# EAGLE design ardcore_smd (EAGLE 7.6.0)

## Sheet 1 of 2
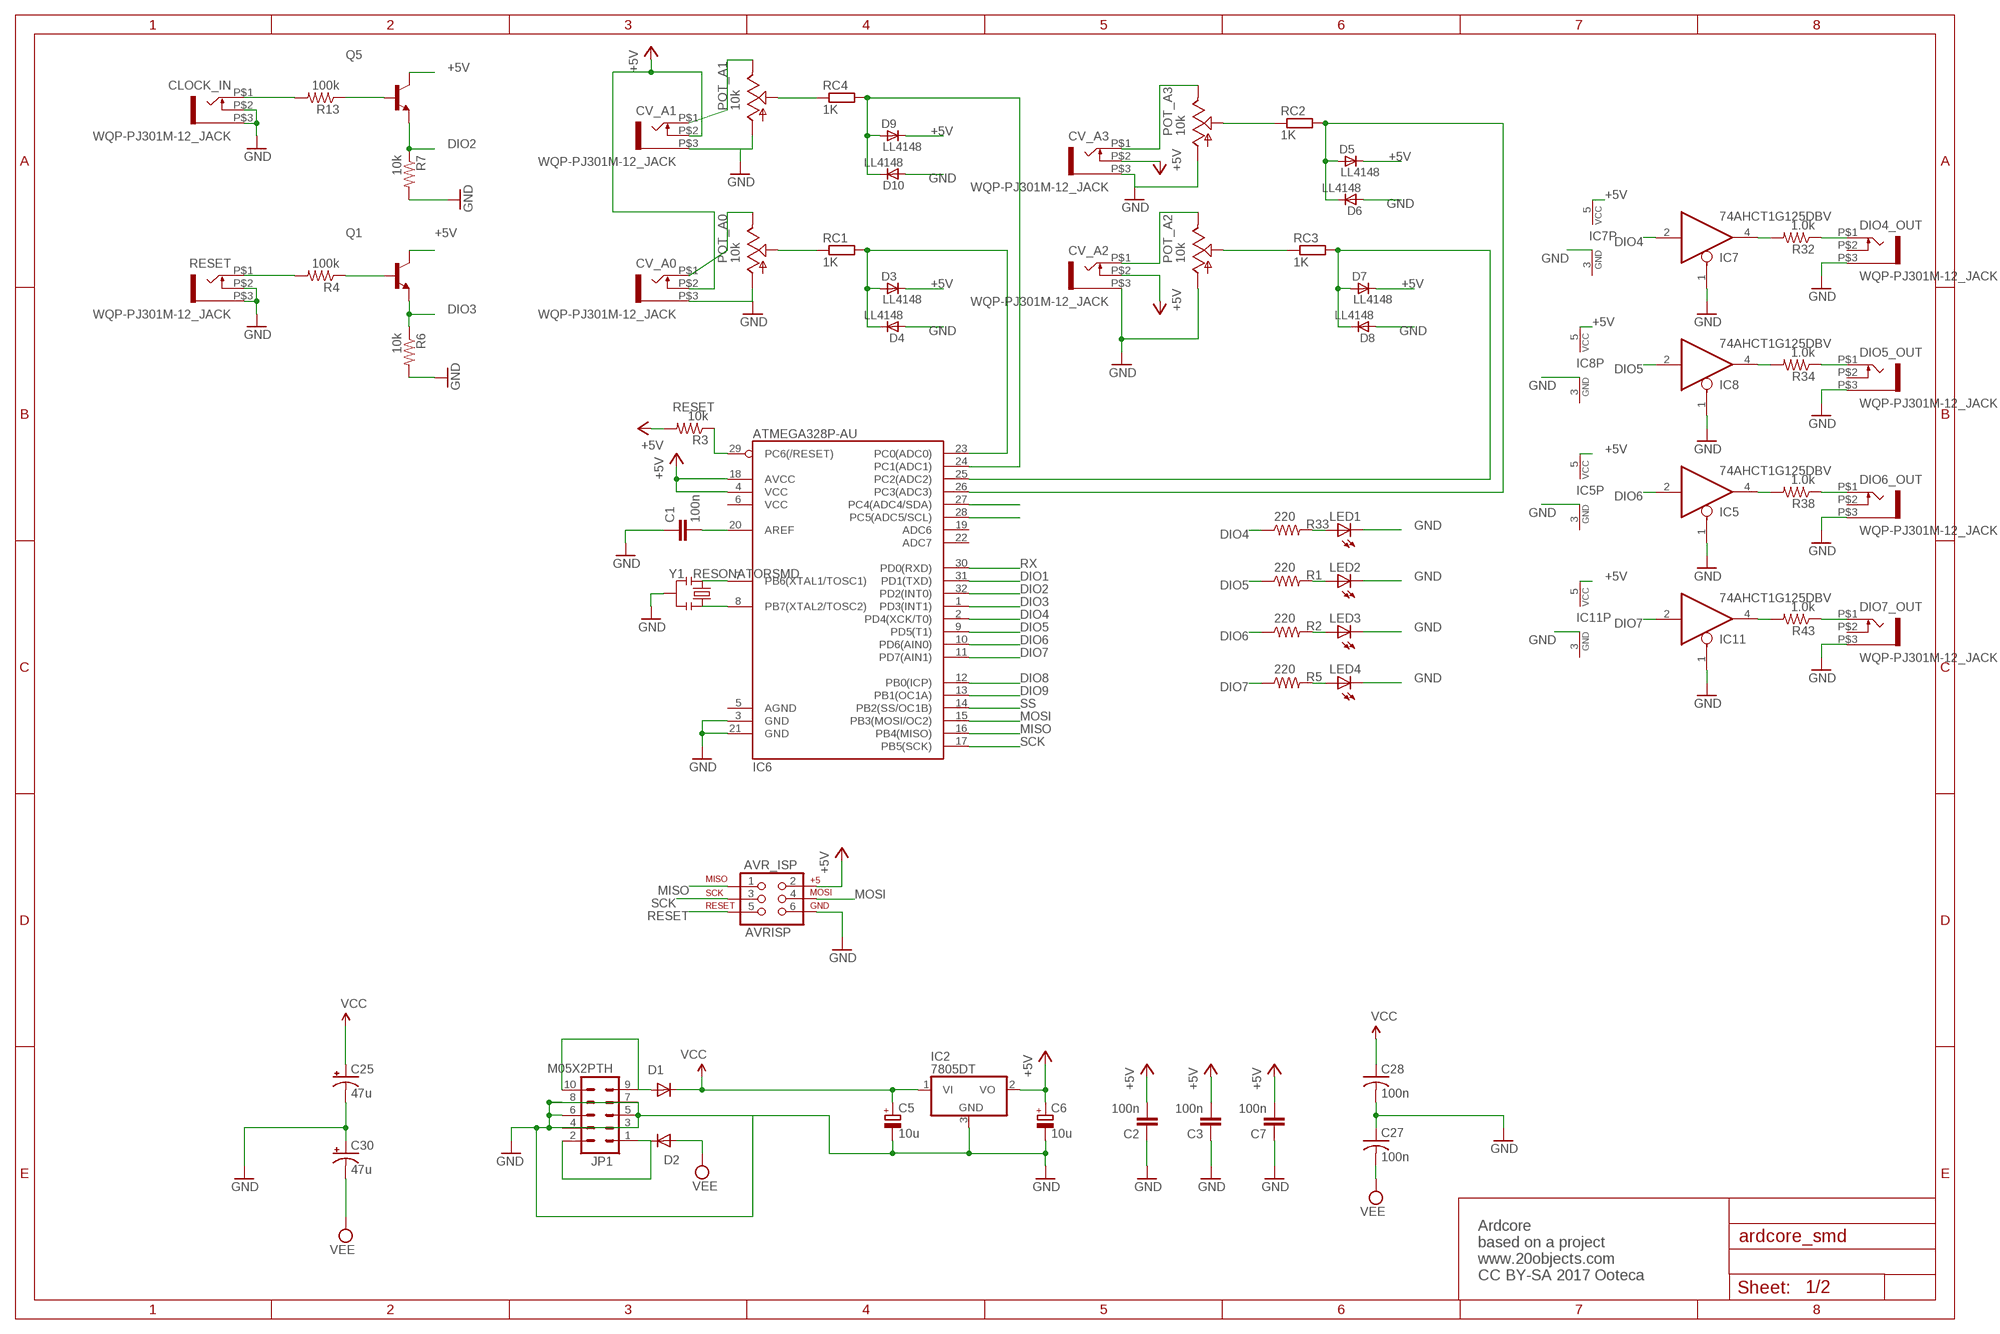
[diagram p0: schematic, sheet 1]

### Parts
AVR_ISP  AVRISP  AVR_SPI_PRG_6PTH  [2X3]
C1  100n  C-EUC0603  [C0603]
C2  100n  C-EUC0603  [C0603]
C3  100n  C-EUC0603  [C0603]
C5  10u  CPOL-EUE2.5-5  [E2,5-5]
C6  10u  CPOL-EUE2.5-5  [E2,5-5]
C7  100n  C-EUC0805  [C0805]
C25  47u  CPOL-USD  [PANASONIC_D]
C27  100n  C-USC0603  [C0603]
C28  100n  C-USC0603  [C0603]
C30  47u  CPOL-USD  [PANASONIC_D]
CLOCK_IN  WQP-PJ301M-12_JACK  [WQP-PJ301M-12_JACK]
CV_A0  WQP-PJ301M-12_JACK  [WQP-PJ301M-12_JACK]
CV_A1  WQP-PJ301M-12_JACK  [WQP-PJ301M-12_JACK]
CV_A2  WQP-PJ301M-12_JACK  [WQP-PJ301M-12_JACK]
CV_A3  WQP-PJ301M-12_JACK  [WQP-PJ301M-12_JACK]
D1  1N5819  DIODE-SOD123  [SOD123]
D2  1N5819  DIODE-SOD123  [SOD123]
D3  LL4148  [SOD80_DO213AA_MINIMELF]
D4  LL4148  [SOD80_DO213AA_MINIMELF]
D5  LL4148  [SOD80_DO213AA_MINIMELF]
D6  LL4148  [SOD80_DO213AA_MINIMELF]
D7  LL4148  [SOD80_DO213AA_MINIMELF]
D8  LL4148  [SOD80_DO213AA_MINIMELF]
D9  LL4148  [SOD80_DO213AA_MINIMELF]
D10  LL4148  [SOD80_DO213AA_MINIMELF]
DIO4_OUT  WQP-PJ301M-12_JACK  [WQP-PJ301M-12_JACK]
DIO5_OUT  WQP-PJ301M-12_JACK  [WQP-PJ301M-12_JACK]
DIO6_OUT  WQP-PJ301M-12_JACK  [WQP-PJ301M-12_JACK]
DIO7_OUT  WQP-PJ301M-12_JACK  [WQP-PJ301M-12_JACK]
IC2  7805DT  [TO252]
IC5  74AHCT1G125DBV  [SOT23-5]
IC6  ATMEGA328P-AU  ATMEGA168  [TQFP32-08]
IC7  74AHCT1G125DBV  [SOT23-5]
IC8  74AHCT1G125DBV  [SOT23-5]
IC11  74AHCT1G125DBV  [SOT23-5]
JP1  M05X2PTH  [AVR_ICSP]
LED1  LED3MM  [LED3MM]
LED2  LED3MM  [LED3MM]
LED3  LED3MM  [LED3MM]
LED4  LED3MM  [LED3MM]
POT_A0  10k  POT_USVERTICAL  [ALPS_POT_VERTICAL]
POT_A1  10k  POT_USVERTICAL  [ALPS_POT_VERTICAL]
POT_A2  10k  POT_USVERTICAL  [ALPS_POT_VERTICAL]
POT_A3  10k  POT_USVERTICAL  [ALPS_POT_VERTICAL]
Q1  MMBT3904LT1-NPN-SOT23-BEC  [SOT23-BEC]
Q5  MMBT3904LT1-NPN-SOT23-BEC  [SOT23-BEC]
R1  220  R-US_R0603  [R0603]
R2  220  R-US_R0603  [R0603]
R3  10k  R-US_R0603  [R0603]
R4  100k  R-US_R0603  [R0603]
R5  220  R-US_R0603  [R0603]
R6  10k  R-US_R0603  [R0603]
R7  10k  R-US_R0603  [R0603]
R13  100k  R-US_R0603  [R0603]
R32  1.0k  R-US_R0603  [R0603]
R33  220  R-US_R0603  [R0603]
R34  1.0k  R-US_R0603  [R0603]
R38  1.0k  R-US_R0603  [R0603]
R43  1.0k  R-US_R0603  [R0603]
RC1  1K  R-EU_R0603  [R0603]
RC2  1K  R-EU_R0603  [R0603]
RC3  1K  R-EU_R0603  [R0603]
RC4  1K  R-EU_R0603  [R0603]
RESET  WQP-PJ301M-12_JACK  [WQP-PJ301M-12_JACK]
Y1  RESONATORSMD  [RESONATOR-SMD]

### Nets
+5V: AVR_ISP.2 C2.2 C3.2 C6.+ C7.2 CV_A0.P$2 CV_A1.P$2 CV_A2.P$2 CV_A3.P$2 D3.C D5.C D7.C D9.C IC2.2(VO) IC5.5(VCC) IC6.4(VCC) IC6.18(AVCC) IC7.5(VCC) IC8.5(VCC) IC11.5(VCC) Q1.C Q5.C R3.2 ; also sheet 2
ANI1: D9.A D10.C IC6.24(PC1(ADC1)) RC4.2
ANI2: D3.A D4.C IC6.23(PC0(ADC0)) RC1.2
ANI3: D5.A D6.C IC6.26(PC3(ADC3)) RC2.2
ANI4: D7.A D8.C IC6.25(PC2(ADC2)) RC3.2
DIO1: IC6.31(PD1(TXD))
DIO2: IC6.32(PD2(INT0)) Q5.E R7.1
DIO3: IC6.1(PD3(INT1)) Q1.E R6.1
DIO4: IC6.2(PD4(XCK/T0)) IC7.2(I) R33.1
DIO5: IC6.9(PD5(T1)) IC8.2(I) R1.1
DIO6: IC5.2(I) IC6.10(PD6(AIN0)) R2.1
DIO7: IC6.11(PD7(AIN1)) IC11.2(I) R5.1
DIO8: IC6.12(PB0(ICP))
DIO9: IC6.13(PB1(OC1A))
GND: AVR_ISP.6 C1.1 C2.1 C3.1 C5.- C6.- C7.1 C25.- C27.1 C28.2 C30.+ CLOCK_IN.P$2 CLOCK_IN.P$3 CV_A0.P$3 CV_A1.P$3 CV_A2.P$3 CV_A3.P$3 D4.A D6.A D8.A D10.A DIO4_OUT.P$3 DIO5_OUT.P$3 DIO6_OUT.P$3 DIO7_OUT.P$3 IC2.3(GND) IC5.1(OE) IC6.3(GND) IC6.21(GND) IC7.1(OE) IC8.1(OE) IC11.1(OE) JP1.3 JP1.4 JP1.5 JP1.6 JP1.7 JP1.8 LED1.K(C) LED2.K(C) LED3.K(C) LED4.K(C) POT_A0.P$3(A) POT_A1.P$3(A) POT_A2.P$3(A) POT_A3.P$3(A) R6.2 R7.2 RESET.P$2 RESET.P$3 Y1.2 ; also sheet 2
MISO: AVR_ISP.1 IC6.16(PB4(MISO))
MOSI: AVR_ISP.4 IC6.15(PB3(MOSI/OC2)) ; also sheet 2
N$3: CV_A2.P$1 POT_A2.P$1(E)
N$5: D1.A JP1.9 JP1.10
N$6: D2.C JP1.1 JP1.2
N$7: DIO6_OUT.P$1 R38.1
N$8: C1.2 IC6.20(AREF)
N$9: DIO5_OUT.P$1 R34.1
N$10: DIO7_OUT.P$1 R43.1
N$11: DIO4_OUT.P$1 R32.1
N$12: CV_A3.P$1 POT_A3.P$1(E)
N$13: IC7.4(O) R32.2
N$14: Q1.B R4.1
N$15: R4.2 RESET.P$1
N$16: IC8.4(O) R34.2
N$17: Q5.B R13.1
N$18: IC6.7(PB6(XTAL1/TOSC1)) Y1.1
N$19: IC6.8(PB7(XTAL2/TOSC2)) Y1.3
N$20: LED2.A R1.2
N$21: LED3.A R2.2
N$22: CLOCK_IN.P$1 R13.2
N$23: LED4.A R5.2
N$25: CV_A0.P$1 POT_A0.P$1(E)
N$27: POT_A3.P$2(S) RC2.1
N$28: CV_A1.P$1 POT_A1.P$1(E)
N$29: POT_A2.P$2(S) RC3.1
N$30: POT_A0.P$2(S) RC1.1
N$31: POT_A1.P$2(S) RC4.1
N$45: IC5.4(O) R38.2
N$46: IC11.4(O) R43.2
N$54: LED1.A R33.2
RESET: AVR_ISP.5 IC6.29(PC6(/RESET)) R3.1
RX: IC6.30(PD0(RXD))
SCK: AVR_ISP.3 IC6.17(PB5(SCK)) ; also sheet 2
SS: IC6.14(PB2(SS/OC1B)) ; also sheet 2
SW_BLUE: IC6.28(PC5(ADC5/SCL))
SW_YELLOW: IC6.27(PC4(ADC4/SDA))
VCC: C5.+ C25.+ C28.1 D1.C IC2.1(VI) ; also sheet 2
VEE: C27.2 C30.- D2.A ; also sheet 2
Unconnected: DIO4_OUT.P$2 DIO5_OUT.P$2 DIO6_OUT.P$2 DIO7_OUT.P$2 IC6.5(AGND) IC6.6(VCC) IC6.19(ADC6) IC6.22(ADC7)

### Notes on the sheet
- Ardcore
  based on a project
  www.20objects.com
  CC BY-SA 2017 Ooteca

## Sheet 2 of 2
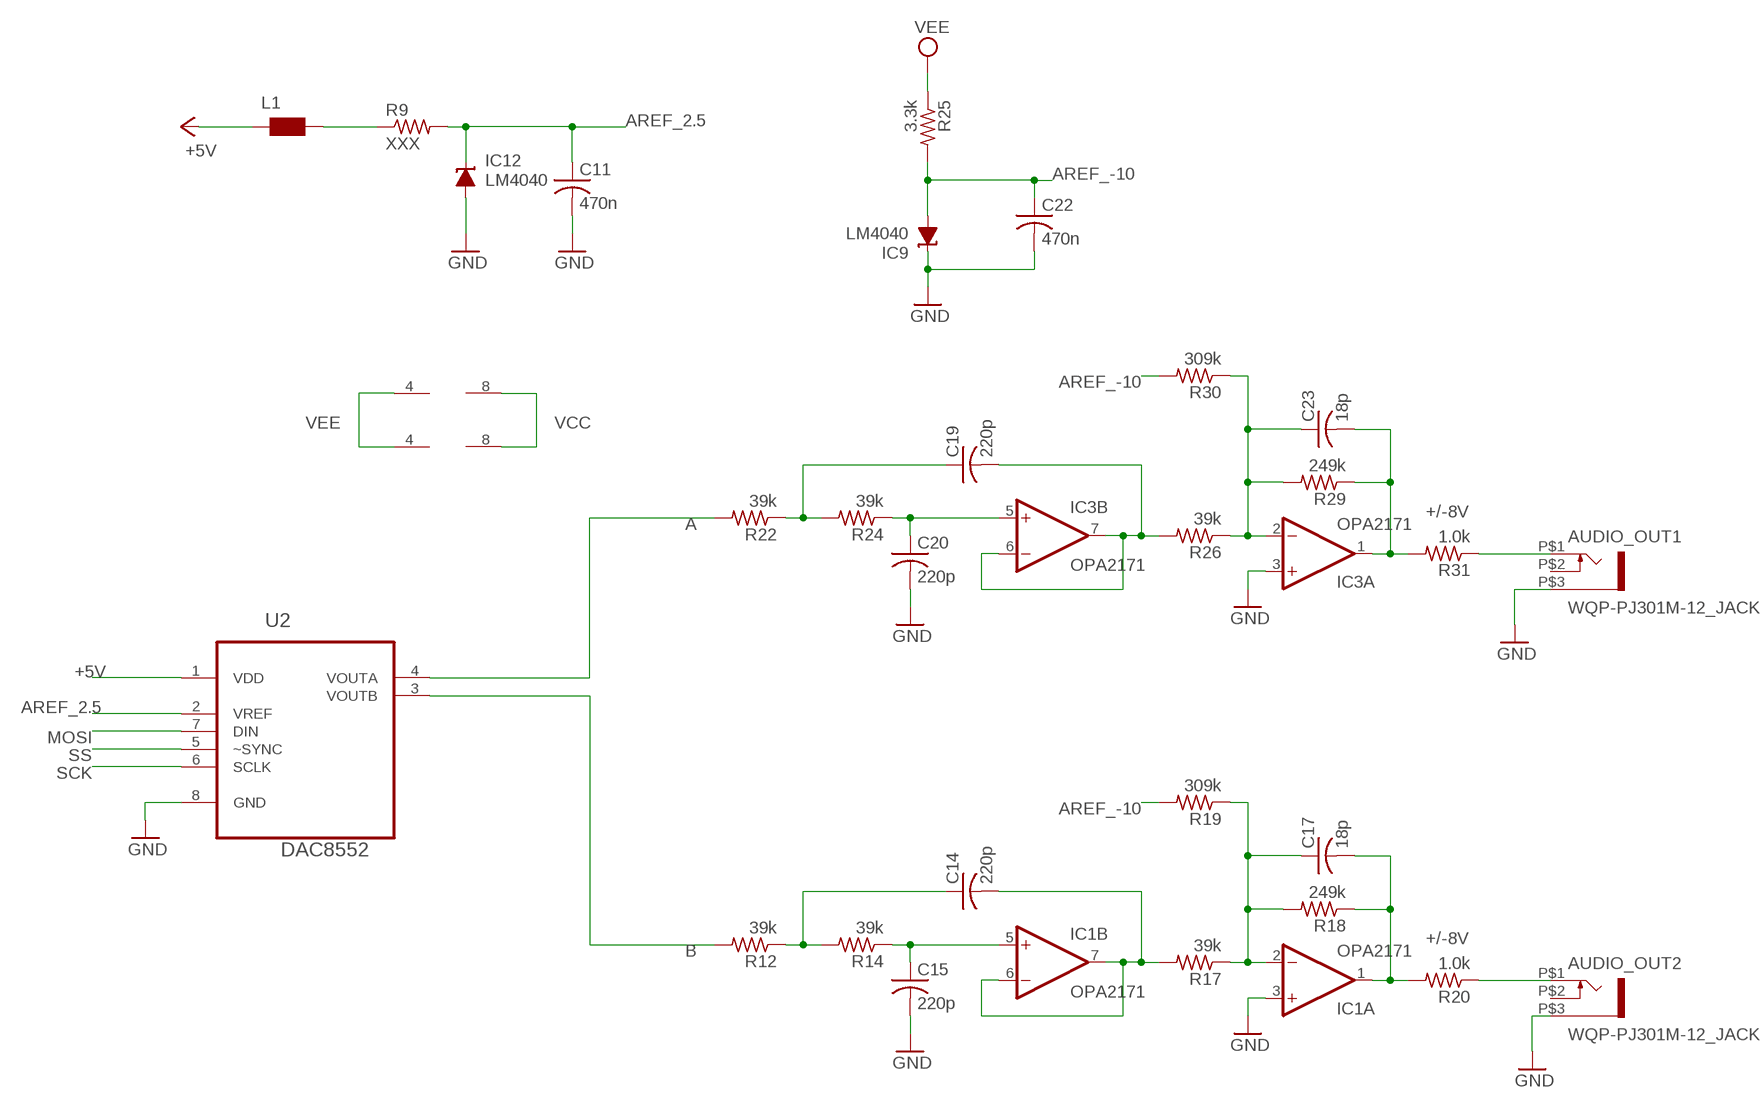
[diagram p1: schematic, sheet 2]

### Parts
AUDIO_OUT1  WQP-PJ301M-12_JACK  [WQP-PJ301M-12_JACK]
AUDIO_OUT2  WQP-PJ301M-12_JACK  [WQP-PJ301M-12_JACK]
C11  470n  C-USC0603  [C0603]
C14  220p  C-USC0603  [C0603]
C15  220p  C-USC0603  [C0603]
C17  18p  C-USC0603  [C0603]
C19  220p  C-USC0603  [C0603]
C20  220p  C-USC0603  [C0603]
C22  470n  C-USC0603  [C0603]
C23  18p  C-USC0603  [C0603]
IC1  OPA2171  TL072D  [SO08]
IC3  OPA2171  TL072D  [SO08]
IC9  LM4040  LM4041B12DBZ  [DBZ_R-PDSO-G3]
IC12  LM4040  LM4041B12DBZ  [DBZ_R-PDSO-G3]
L1  WE-CBF_0603  [0603]
R9  XXX  R-US_R0603  [R0603]
R12  39k  R-US_R0603  [R0603]
R14  39k  R-US_R0603  [R0603]
R17  39k  R-US_R0603  [R0603]
R18  249k  R-US_R0603  [R0603]
R19  309k  R-US_R0603  [R0603]
R20  1.0k  R-US_R0603  [R0603]
R22  39k  R-US_R0603  [R0603]
R24  39k  R-US_R0603  [R0603]
R25  3.3k  R-US_R0603  [R0603]
R26  39k  R-US_R0603  [R0603]
R29  249k  R-US_R0603  [R0603]
R30  309k  R-US_R0603  [R0603]
R31  1.0k  R-US_R0603  [R0603]
U2  DAC8552  DAC8552IDGKT  [SOP65P490X110-8N]

### Nets
+5V: L1.1 U2.1(VDD) ; also sheet 1
A: R22.2 U2.4(VOUTA)
AREF_2.5: C11.1 IC12.1(C) R9.2 U2.2(VREF)
AREF_-10: C22.1 IC9.2(A) R19.2 R25.2 R30.2
B: R12.2 U2.3(VOUTB)
BI_OUT: C17.2 IC1.1(A:OUT) R18.1 R20.2
BI_OUT1: C23.2 IC3.1(A:OUT) R29.1 R31.2
F_CV: C17.1 IC1.2(A:-IN) R17.1 R18.2 R19.1
F_CV1: C23.1 IC3.2(A:-IN) R26.1 R29.2 R30.1
GND: AUDIO_OUT1.P$3 AUDIO_OUT2.P$3 C11.2 C15.2 C20.2 C22.2 IC1.3(A:+IN) IC3.3(A:+IN) IC9.1(C) IC12.2(A) U2.8(GND) ; also sheet 1
MOSI: U2.7(DIN) ; also sheet 1
N$1: C14.1 R12.1 R14.2
N$2: AUDIO_OUT2.P$1 R20.1
N$4: C19.2 IC3.6(B:-IN) IC3.7(B:OUT) R26.2
N$24: C20.1 IC3.5(B:+IN) R24.1
N$26: C19.1 R22.1 R24.2
N$32: AUDIO_OUT1.P$1 R31.1
N$33: L1.2 R9.1
N$42: C14.2 IC1.6(B:-IN) IC1.7(B:OUT) R17.2
N$43: C15.1 IC1.5(B:+IN) R14.1
SCK: U2.6(SCLK) ; also sheet 1
SS: U2.5(~SYNC) ; also sheet 1
VCC: IC1.8(P:V+) IC3.8(P:V+) ; also sheet 1
VEE: IC1.4(P:V-) IC3.4(P:V-) R25.1 ; also sheet 1
Unconnected: AUDIO_OUT1.P$2 AUDIO_OUT2.P$2

### Notes on the sheet
- +/-8V
- +/-8V

## Power pins joined to a net without a drawn wire
GND: IC5.3(GND) IC7.3(GND) IC8.3(GND) IC11.3(GND)

## Library data of the parts
AUDIO_OUT1 AUDIO_OUT2 CLOCK_IN CV_A0 CV_A1-CV_A3 DIO4_OUT DIO5_OUT DIO6_OUT DIO7_OUT RESET = thonkiconn:WQP-PJ301M-12_JACK
AVR_ISP = SparkFun:AVR_SPI_PRG_6: AVR ISP 6 Pin This is the reduced ISP connector for AVR programming. Common on Arduino. This footprint will take up less PCB space and can be used with a 10-pin to 6-pin adapter such as SKU: BOB-08508
C1-C3 C7 = rcl:C-EU: CAPACITOR, European symbol
C5 C6 = rcl:CPOL-EU: POLARIZED CAPACITOR, European symbol
C11 C14 C15 C17 C19 C20 C22 C23 C27 C28 = rcl:C-US: CAPACITOR, American symbol
C25 C30 = rcl:CPOL-US: POLARIZED CAPACITOR, American symbol
D1 D2 = diode:DIODE-: DIODE
D3-D10 = hhn_diodes_smd:LL4148: 1N4148 General Purpose Rectifie SMD-Version of 1N4148 Case: SOD 80 = DO 213 AA = MINIMELF (Glass) Author: Dipl.-Ing. FH Rainer Bayer HHN Hochschule Heilbronn, rainer.bayer@hs-heilbronn.de Ingenieurbüro ing-rb, mail@ing-rb.de
IC1 IC3 = linear:TL072: OP AMP
IC2 = linear:78*: Positive VOLTAGE REGULATOR Source: http://cache.national.com/ds/LM/LM78L05.pdf http://www.fairchildsemi.com/ds/LM/LM7805.pdf
IC5 IC7 IC8 IC11 = 74xx-little-us:74*1G125: Single Bus Buffer Gate with 3-State Output
IC6 = SparkFun:ATMEGA168
IC9 IC12 = texas:LM4041: PRECISION MICROPOWER SHUNT VOLTAGE REFERENCE Source: http://focus.ti.com/lit/ds/slcs146e/slcs146e.pdf
JP1 = og-header:M05X2: Header 5x2 Standard 10-pin dual row 0.1" header. Commonly used with AVR-ISP. Use with Spark Fun Electronics SKU: PRT-00778
L1 = wuerth-elektronik:WE-CBF: SMD EMI Suppression Ferrite Beads - excellent anti-EMI properties - low DCR - impedances till 3000 ohms - rated current up to 6 A
LED1-LED4 = led:LED: LED OSRAM: - CHIPLED LG R971, LG N971, LY N971, LG Q971, LY Q971, LO R971, LY R971 LH N974, LH R974 LS Q976, LO Q976, LY Q976 LO Q996 - Hyper CHIPLED LW Q18S LB Q993, LB Q99A, LB R99A - SideLED LS A670, LO A670, LY A670, LG A670, LP A670 LB A673, LV A673, LT A673, LW A673 LH A674 LY A675 LS A676, LA A676, LO A676, LY A676, LW A676 LS A679, LY A679, LG A679 - Hyper Micro SIDELED® LS Y876, LA Y876, LO Y876, LY Y876 LT Y87S - SmartLED LW L88C, LW L88S LB L89C, LB L89S, LG L890 LS L89K, LO L89K, LY L89K LS L896, LA L896, LO L896, LY L896 - TOPLED LS T670, LO T670, LY T670, LG T670, LP T670 LSG T670, LSP T670, LSY T670, LOP T670, LYG T670 LG T671, LOG T671, LSG T671 LB T673, LV T673, LT T673, LW T673 LH T674 LS T676, LA T676, LO T676, LY T676, LB T676, LH T676, LSB T676, LW T676 LB T67C, LV T67C, LT T67C, LS T67K, LO T67K, LY T67K, LW E67C LS E67B, LA E67B, LO E67B, LY E67B, LB E67C, LV E67C, LT E67C LW T67C LS T679, LY T679, LG T679 LS T770, LO T770, LY T770, LG T770, LP T770 LB T773, LV T773, LT T773, LW T773 LH T774 LS E675, LA E675, LY E675, LS T675 LS T776, LA T776, LO T776, LY T776, LB T776 LHGB T686 LT T68C, LB T68C - Hyper Mini TOPLED® LB M676 - Mini TOPLED Santana® LG M470 LS M47K, LO M47K, LY M47K Source: http://www.osram.convergy.de LUXEON: - LUMILED® LXK2-PW12-R00, LXK2-PW12-S00, LXK2-PW14-U00, LXK2-PW14-V00 LXK2-PM12-R00, LXK2-PM12-S00, LXK2-PM14-U00 LXK2-PE12-Q00, LXK2-PE12-R00, LXK2-PE12-S00, LXK2-PE14-T00, LXK2-PE14-U00 LXK2-PB12-K00, LXK2-PB12-L00, LXK2-PB12-M00, LXK2-PB14-N00, LXK2-PB14-P00, LXK2-PB14-Q00 LXK2-PR12-L00, LXK2-PR12-M00, LXK2-PR14-Q00, LXK2-PR14-R00 LXK2-PD12-Q00, LXK2-PD12-R00, LXK2-PD12-S00 LXK2-PH12-R00, LXK2-PH12-S00 LXK2-PL12-P00, LXK2-PL12-Q00, LXK2-PL12-R00 Source: www.luxeon.com KINGBRIGHT: KA-3528ASYC Source: www.kingbright.com
POT_A0 POT_A1-POT_A3 = pot-alps:POT_US
Q1 Q5 = transistor:*-NPN-: NPN Transistror BF959 corrected 2008.03.06
R1-R7 R9 R12-R14 R17-R20 R22 R24-R26 R29-R34 R38 R43 = rcl:R-US_: RESISTOR, American symbol
RC1-RC4 = rcl:R-EU_: RESISTOR, European symbol
U2 = Texas Instruments_By_element14_Batch_1:DAC8552IDGKT: 0.05ìV/°C max, SINGLE-SUPPLY CMOS OPERATIONAL AMPLIFIERS Zer.-Drift Series; MPN: DAC8552IDGKT; OC_FARNELL: -; OC_NEWARK: 06M7244; PACKAGE: MSOP-8; SUPPLIER: Texas Instruments
Y1 = SparkFun:RESONATOR: Resonator Small SMD resonator. This is the itty bitty 10/20MHz resonators with built in caps. CSTCE10M0G55 and CSTCE20M0V53. Footprint has been reviewed closely but hasn't been tested yet.

## Net classes
2 Power: width 0.61 mm, drill 0.508 mm, clearance 0.305 mm
3 GND: width 0.61 mm, drill 0.508 mm, clearance 0.305 mm

## Board
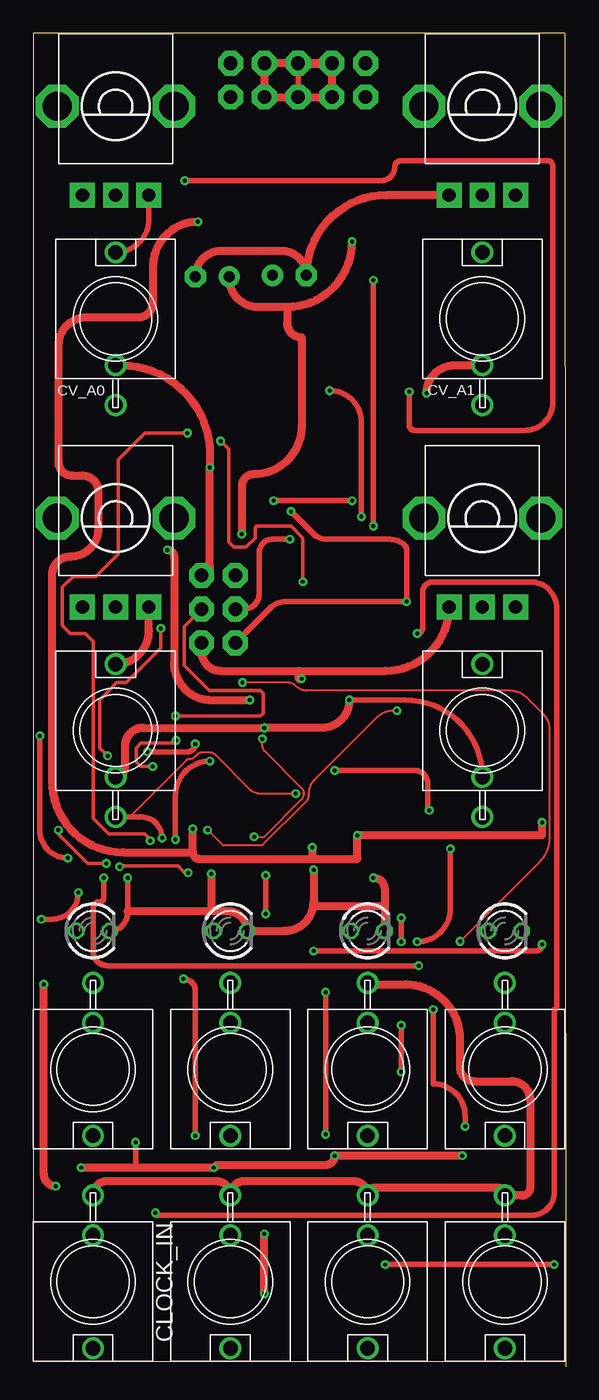
[diagram p2: board, top side]
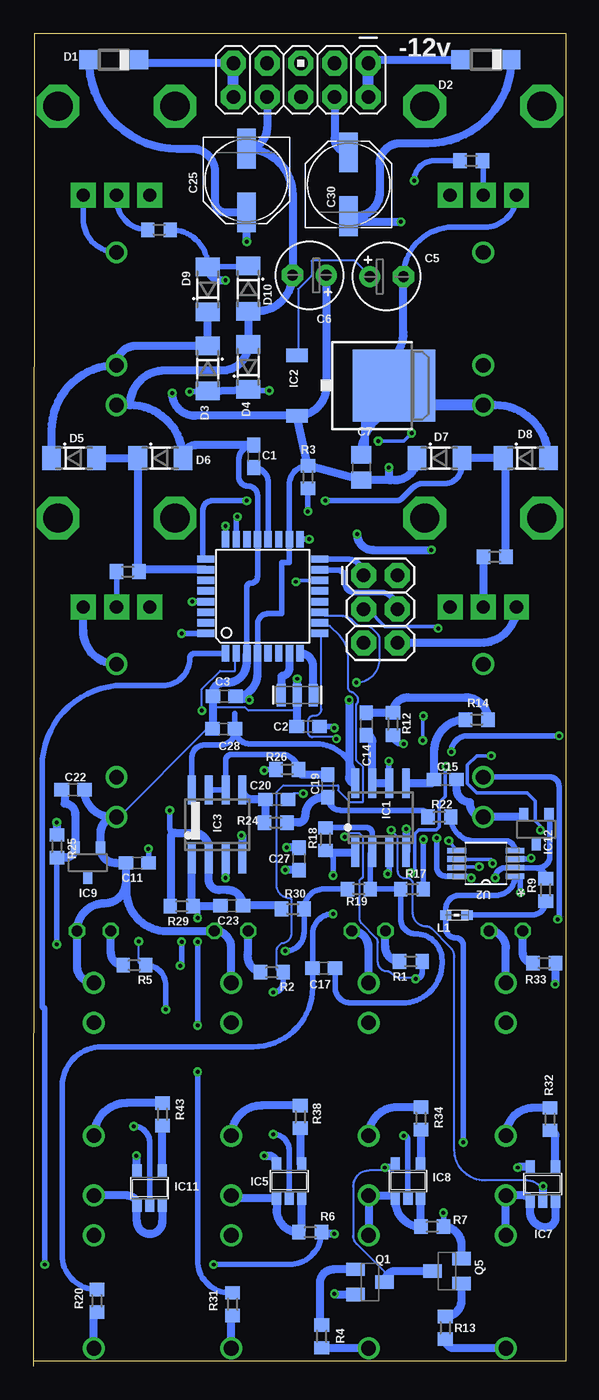
[diagram p3: board, bottom side, seen from below]

Size 40.07 x 100.36 mm. Coordinates in mm from the lower left corner, seen from the top.
Outline: 40,100.36 0,100.36 0,0.36 40,0.36
Outline: 39.99,100.33 40.07,0
Copper layers (1*16): Top 0.0356mm / dielectric 1.5011mm / Bottom 0.0356mm
Design rules "default": minimum track width 6mil, minimum drill 13mil, track to track 6mil, track to pad 6mil, pad to pad 6mil, via to via 6mil, smd to smd 6mil, copper to edge 15mil, drill to drill 6mil, minimum pad ring 7mil, minimum via ring 7mil, stop-mask expansion 3mil, vias tented up to drill 31mil, thermal gap 10mil

### Footprints (pad centres in the part's own frame; a part is rotated, then mirrored left to right if it is on the bottom)
WQP-PJ301M-12_JACK = drill 1.1: P$1 0,5; P$2 0,-3.5; P$3 0,-6.5
2X3 = drill 1.016 pad 1.88 octagon: 1 0,0; 2 0,2.54; 3 2.54,0; 4 2.54,2.54; 5 5.08,0; 6 5.08,2.54
C0603 = smd 1.1 x 1: 1 -0.85,0; 2 0.85,0
E2,5-5 = drill 0.813 pad 1.6: + -1.27,0 | drill 0.813 pad 1.6 octagon: - 1.27,0
C0805 = smd 1.3 x 1.5: 1 -0.95,0; 2 0.95,0
PANASONIC_D = smd 3 x 1.4: + 2.4,0; - -2.4,0
SOD123 = smd 1.4 x 1.4: A 1.9,0; C -1.9,0
SOD80_DO213AA_MINIMELF = smd 1.4 x 1.8: A 1.7,0; C -1.7,0
SO08 = smd 0.6 x 2.2: 1 -1.905,-2.6; 2 -0.635,-2.6; 3 0.635,-2.6; 4 1.905,-2.6; 5 1.905,2.6; 6 0.635,2.6; 7 -0.635,2.6; 8 -1.905,2.6
TO252 = smd 1 x 1.6: 1 -2.28,-4.8; 2 2.28,-4.8 | smd 5.4 x 6.2: 3 0,2.5
SOT23-5 = smd 0.69 x 0.99: 1 -0.95,-1.29; 2 0,-1.29; 3 0.95,-1.29; 4 0.95,1.3; 5 -0.95,1.3
TQFP32-08 = smd 1.27 x 0.559: 1 -4.293,2.8; 2 -4.293,2; 3 -4.293,1.2; 4 -4.293,0.4; 5 -4.293,-0.4; 6 -4.293,-1.2; 7 -4.293,-2; 8 -4.293,-2.8; 17 4.293,-2.8; 18 4.293,-2; 19 4.293,-1.2; 20 4.293,-0.4; 21 4.293,0.4; 22 4.293,1.2; 23 4.293,2; 24 4.293,2.8 | smd 0.559 x 1.27: 9 -2.8,-4.293; 10 -2,-4.293; 11 -1.2,-4.293; 12 -0.4,-4.293; 13 0.4,-4.293; 14 1.2,-4.293; 15 2,-4.293; 16 2.8,-4.293; 25 2.8,4.293; 26 2,4.293; 27 1.2,4.293; 28 0.4,4.293; 29 -0.4,4.293; 30 -1.2,4.293; 31 -2,4.293; 32 -2.8,4.293
DBZ_R-PDSO-G3 = smd 0.7 x 1: 1 -0.95,-1.1; 2 0.95,-1.1; 3 0,1.1
AVR_ICSP = drill 1.016 pad 1.88 octagon: 1 -1.27,5.08; 2 1.27,5.08; 3 -1.27,2.54; 4 1.27,2.54; 5 -1.27,0; 6 1.27,0; 7 -1.27,-2.54; 8 1.27,-2.54; 9 -1.27,-5.08; 10 1.27,-5.08
0603 = smd 0.85 x 0.7: 1 -0.9,0; 2 0.7,0
LED3MM = drill 0.813 octagon: A -1.27,0; K 1.27,0
ALPS_POT_VERTICAL = drill 1 pad 1.88 square: P$1 -2.5,6.7; P$2 0,6.7; P$3 2.5,6.7 | drill 2.2 pad 3.175 octagon: P$4 -4.4,0; P$5 4.4,0
SOT23-BEC = smd 1 x 1.4: B -0.95,-1.1; C 0,1.1; E 0.95,-1.1
R0603 = smd 1 x 1.1: 1 -0.85,0; 2 0.85,0
SOP65P490X110-8N = smd 1.422 x 0.432: 1 -2.184,0.965; 2 -2.184,0.33; 3 -2.184,-0.33; 4 -2.184,-0.965; 5 2.184,-0.965; 6 2.184,-0.33; 7 2.184,0.33; 8 2.184,0.965
RESONATOR-SMD = smd 0.7 x 1.7: 1 -1.2,0; 2 0,0; 3 1.2,0

### Placement (x,y rotation side)
AUDIO_OUT1  25.17,6.36 180 top
AUDIO_OUT2  35.5,6.36 180 top
AVR_ISP  15.21,59.54 270 bottom
C1  23.48,68.5 270 bottom
C2  19.39,48.16 0 bottom
C3  25.68,50.44 0 bottom
C5  13.47,82.04 0 bottom
C6  19.29,82.14 180 bottom
C7  15.38,67.66 270 bottom
C11  32.23,37.9 180 bottom
C14  15,48.36 270 bottom
C15  9.06,44.18 0 bottom
C17  18.2,29.98 180 bottom
C19  17.9,43.68 90 bottom
C20  21.74,42.68 0 bottom
C22  37.07,43.4 0 bottom
C23  25.13,34.68 180 bottom
C25  24.03,89.27 270 bottom
C27  20.07,38.2 90 bottom
C28  25.73,47.99 180 bottom
C30  16.33,88.98 90 bottom
CLOCK_IN  4.5,6.36 180 top
CV_A0  6.2,78.86 0 top
CV_A1  33.8,78.86 0 top
CV_A2  6.2,47.86 0 top
CV_A3  33.8,47.86 0 top
D1  34,98.36 0 bottom
D2  6,98.36 0 bottom
D3  26.92,75.12 270 bottom
D4  23.89,75.24 90 bottom
D5  37,68.36 0 bottom
D6  30.5,68.36 0 bottom
D7  9.5,68.36 0 bottom
D8  3,68.36 0 bottom
D9  26.92,81.07 90 bottom
D10  23.88,81.13 270 bottom
DIO4_OUT  4.5,22.36 180 top
DIO5_OUT  14.83,22.36 180 top
DIO6_OUT  25.17,22.36 180 top
DIO7_OUT  35.5,22.36 180 top
IC1  13.92,41.29 0 bottom
IC2  15.43,73.83 270 bottom
IC3  26.23,40.79 0 bottom
IC5  20.81,13.94 0 bottom
IC6  22.79,57.97 90 bottom
IC7  1.72,13.71 0 bottom
IC8  11.87,13.95 0 bottom
IC9  35.96,37.92 180 bottom
IC11  31.31,13.42 0 bottom
IC12  2.21,40.42 180 bottom
JP1  19.93,96.83 270 bottom
L1  8.12,33.97 0 bottom
LED1  4.5,32.78 0 top
LED2  14.83,32.78 0 top
LED3  25.17,32.78 0 top
LED4  35.5,32.78 0 top
POT_A0  6.2,94.86 180 top
POT_A1  33.8,94.86 180 top
POT_A2  6.2,63.86 180 top
POT_A3  33.8,63.86 180 top
Q1  14.72,6.35 270 bottom
Q5  8.93,7.17 90 bottom
R1  11.65,30.48 180 bottom
R2  22.11,29.66 180 bottom
R3  19.39,66.95 90 bottom
R4  18.36,2.25 270 bottom
R5  32.45,30.2 180 bottom
R6  19.23,10.1 180 bottom
R7  10.04,10.51 180 bottom
R9  1.5,35.86 90 bottom
R12  13,48.36 270 bottom
R13  9.06,2.9 270 bottom
R14  6.69,48.68 0 bottom
R17  11.56,35.93 0 bottom
R18  18.08,39.68 90 bottom
R19  15.56,35.93 180 bottom
R20  35.28,4.93 90 bottom
R22  9.5,41.36 0 bottom
R24  21.82,40.93 0 bottom
R25  38.29,39.15 270 bottom
R26  20.95,44.93 0 bottom
R29  28.9,34.63 180 bottom
R30  20.54,34.43 0 bottom
R31  25.06,4.68 90 bottom
R32  1.18,18.61 270 bottom
R33  1.61,30.36 180 bottom
R34  10.9,18.66 270 bottom
R38  19.97,18.78 270 bottom
R43  30.34,18.97 270 bottom
RC1  7.1,90.76 180 bottom
RC2  32.95,59.83 0 bottom
RC3  5.34,60.94 0 bottom
RC4  30.6,85.56 0 bottom
RESET  14.83,6.36 180 top
U2  6,37.86 180 bottom
Y1  20.2,50.53 0 bottom

### Tracks (layer width: path | path; a pad name or v marks a point on that pad's centre or on a via)
+5V  (via drill 0.3)
  Top 0.406: CV_A3.P$2 arc90 28,50.16 v23.8,50.16 | v0.6,33.66 1.4,33.66 arc90 v3.4,35.66 | v7.7,16.86 7.7,14.96
  Top 0.61: CV_A0.P$2 6.6,75.36 arc-90 13.3,68.66 v13.3,67.66 13.3,60.17 arc-90 AVR_ISP.2 | v32.3,15.86 v22.7,15.86 arc-90 22,15.16 13.8,15.16 arc-90 v13.6,14.96 7.7,14.96 v3.6,14.96 | v29.6,73.26 arc-90 31.7,75.36 CV_A1.P$2 | v23.8,50.16 arc-90 21.7,48.06 v17.4,48.06 8.25,48.06 arc90 6.9,46.71 6.9,45.06 arc-90 CV_A2.P$2
  Bottom 0.152: 13.4,6.9 13.62,7.11 15.73,9.22 arc45 16,9.86 16,13.54 arc90 14.8,14.73 13.75,14.73 v13.6,14.96
  Bottom 0.406: R3.2 arc-90 20.79,66.41 IC6.18 20.79,60.51 21.35,60.51 21.35,56.66 22.4,56.66 arc-90 23.19,55.87 IC6.4 | v17.4,48.06 arc-90 17.5,48.16 C2.2 | C3.2 arc-90 24.55,50.16 v23.8,50.16 | CV_A2.P$2 1.2,44.36 arc90 0.5,43.66 0.5,33.76 arc90 v0.6,33.66 | v3.4,35.66 3.4,36.48 arc-90 U2.1 arc90 5.25,35.46 8,35.46 arc-90 9.02,34.44 L1.1 9.02,32.98 arc-90 8.3,32.26 arc90 7.7,31.66 v7.7,16.86
  Bottom 0.61: D9.C D3.C 32.34,76.82 arc-90 CV_A1.P$2 arc-90 38.7,70.46 D5.C | D7.C arc90 12.85,66.71 13.2,66.71 | 13.2,66.71 C7.2 R3.2 IC2.2 | v13.3,67.66 13.3,66.81 arc-90 13.2,66.71 | Q5.C 12.79,7.17 arc-47 13.4,6.9 arc-43 Q1.C | IC11.5 32.26,15.82 arc-90 v32.3,15.86 | v22.7,15.86 22.38,15.86 arc90 IC5.5 | IC7.5 3.55,15.01 arc-90 v3.6,14.96 | v13.6,14.96 13.11,14.96 arc-90 IC8.5 | C3.2 arc-90 23.19,52.09 IC6.4 | C6.+ 18.02,73.77 arc90 IC2.2 | IC2.2 27.89,71.55 arc90 v29.6,73.26
A
  Bottom 0.406: R22.2 arc-90 6.85,39.56 4.55,39.56 arc90 U2.4
ANI1  (via drill 0.3)
  Top 0.406: v25.6,81.76 v25.6,63.26
  Bottom 0.406: D10.C arc90 23.94,82.77 D9.A arc-90 29.71,85.56 RC4.2 | v25.6,63.26 arc90 v25.59,63.25 IC6.24
  Bottom 0.61: D9.A arc-90 25.91,81.76 v25.6,81.76
ANI2  (via drill 0.3)
  Top 0.406: v22.3,73.46 arc-90 24.7,71.06 v24.7,63.96 | v11.4,89.26 26.2,89.26 arc90 27.2,90.26 arc-90 27.7,90.76 38.7,90.76 arc-90 39.1,90.36 39.1,72.56 arc-90 37,70.46 28.7,70.46 arc-90 28.3,70.86 v28.3,73.36
  Bottom 0.406: D4.C arc-90 23.81,73.46 v22.3,73.46 | v24.7,63.96 arc-90 24.79,63.87 IC6.23 | RC1.2 9.9,90.76 arc-90 v11.4,89.26 | v28.3,73.36 26.98,73.36 arc-90 D3.A
  Bottom 0.61: D3.A D4.C
ANI3
  Bottom 0.61: D5.A D6.C 32.2,59.93 arc-90 RC2.2 arc90 31.96,59.97 IC6.26
ANI4  (via drill 0.3)
  Top 0.406: v24,65.16 v18.1,65.16
  Bottom 0.406: IC6.25 arc90 27.3,60.99 27.3,64.46 arc90 26.6,65.16 v24,65.16 | v18.1,65.16 12.8,65.16 arc-45 12.29,65.37 11.52,66.14 arc45 10.75,66.46 9.08,66.46 arc-45 8.26,66.8 8.21,66.85 arc-45 7.8,67.85 D7.A
  Bottom 0.61: D8.C 5.3,68.36 | 5.3,68.36 D7.A | RC3.2 4.49,61.15 arc-90 4.5,61.16 4.5,67.56 arc-90 5.3,68.36
AREF_2.5  (via drill 0.3)
  Top 0.406: v29,30.16 5.6,30.16 arc-90 4.5,31.26 4.5,34.46 arc-90 5,34.96 arc90 5.3,35.26 v5.3,36.76 | v28.9,31.96 arc90 31.4,34.46 v31.4,38.96
  Bottom 0.406: R9.2 arc-90 2.32,37.53 | 2.32,37.53 U2.2 4.53,37.53 arc-90 v5.3,36.76 | IC12.1 arc90 1.2,41.46 1.2,38.36 arc90 2.03,37.53 2.32,37.53 | v29,30.16 arc-90 28.9,30.26 v28.9,31.96 | v31.4,38.96 arc90 31.38,38.94 C11.1
AREF_-10  (via drill 0.3)
  Top 0.406: v21.1,31.26 37.8,31.26 arc90 v38.3,31.76
  Bottom 0.406: R19.2 18.19,35.93 arc-90 R30.2 19.69,32.67 arc90 v21.1,31.26 | v38.3,31.76 R25.2 arc90 R25.2
  Bottom 0.61: R25.2 37.63,38.3 arc-90 IC9.2 36.91,41.57 arc-90 37.7,42.36 37.7,43.18 arc-90 C22.1
B  (via drill 0.3)
  Top 0.406: v2.6,38.26 arc-90 0.5,40.36 v0.5,47.46 | v8.6,46.26 11.6,46.26 arc90 v12.2,46.86
  Bottom 0.406: U2.3 2.67,38.19 arc-90 v2.6,38.26 | v0.5,47.46 7.4,47.46 arc-90 v8.6,46.26 | v12.2,46.86 12.35,46.86 arc90 R12.2
BI_OUT  (via drill 0.3)
  Top 0.406: v17.5,34.06 v17.5,36.96
  Bottom 0.406: v17.5,34.06 arc-90 19.05,32.51 C17.2 19.05,28.51 arc90 23.5,24.06 34.9,24.06 arc-90 37.9,21.06 37.9,8.4 arc-90 R20.2 | v17.5,36.96 17.5,38.25 arc-90 R18.1
  Bottom 0.61: R18.1 arc-90 17.94,38.69 IC1.1
BI_OUT1  (via drill 0.3)
  Top 0.406: v27.7,22.16 v27.7,25.66 | v27.7,31.96 v27.7,33.76
  Bottom 0.406: R31.2 25.27,5.53 arc90 27.7,7.96 v27.7,22.16 | v27.7,25.66 v27.7,31.96 | v27.7,33.76 27.7,34.28 arc-90 R29.1
  Bottom 0.61: C23.2 arc90 26.03,34.63 R29.1 arc90 28.14,34.71 IC3.1
DIO2  (via drill 0.3)
  Top 0.406: v9.2,11.56 arc90 9.4,11.36 37.5,11.36 arc90 39.2,13.06 39.2,26.86 arc90 39.4,27.06 39.4,57.06 arc90 37.4,59.06 30.1,59.06 arc90 29.3,58.26 29.3,55.56 arc-90 v28.9,55.16
  Bottom 0.406: R7.1 v9.19,11.55 arc-90 v9.2,11.56 | v28.9,55.16 27.09,55.16 arc-90 IC6.32
  Bottom 0.61: Q5.E 7.83,9.15 arc-90 R7.1
DIO3  (via drill 0.3)
  Top 0.406: v26.5,7.66 v39.2,7.66
  Top 0.61: v17.4,5.46 v17.4,9.96
  Bottom 0.406: R6.1 arc90 20.82,7.66 v26.5,7.66 | v39.2,7.66 39.2,26.96 arc90 39.4,27.16 39.4,45.16 arc90 33.3,51.26 30.3,51.26 arc-90 28.3,53.26 arc90 27.88,53.68 IC6.1
  Bottom 0.61: Q1.E 17.34,5.4 arc90 v17.4,5.46 | v17.4,9.96 18.24,9.96 arc90 R6.1
DIO4  (via drill 0.3)
  Top 0.152: v27.38,49.36 27.04,49.36 arc45 25.9,48.89 21.18,44.16 arc45 20.75,43.13 20.75,43.02 arc-45 20.55,42.53 17.25,39.23 14.25,39.23 v13.12,40.36
  Top 0.61: v1.7,13.56 arc-90 0.8,14.46 v0.8,28.76
  Bottom 0.152: v27.38,49.36 27.38,50.98 26,52.36 24.88,52.36 24.88,53.61 IC6.2 | v13.12,40.36 12.62,39.86 12.62,37.27 arc-90 12.09,36.73 11.87,36.73 arc45 11.67,36.65 11.59,36.57 arc45 11.5,36.36 11.5,34.14 arc-90 10.47,33.11 arc45 10.09,32.95 8.67,31.53 arc45 8.38,30.82 8.38,16.28 arc-90 6.08,13.98 2.9,13.98 arc45 2,13.61 v1.7,13.56
  Bottom 0.61: IC7.2 arc-90 1.7,12.44 v1.7,13.56 | v0.8,28.76 arc-90 0.76,28.8 R33.1
DIO5  (via drill 0.3)
  Top 0.152: v17.25,47.23 17.25,46.72 arc45 17.42,46.32 20.22,43.52 arc-45 20.38,43.14 arc-45 20.18,42.66 17.38,39.86 v16.62,39.86
  Top 0.406: v12.2,17.36 12.2,28.26 arc90 v11.3,29.16
  Bottom 0.152: v17.25,47.23 17.38,47.36 19.04,47.36 arc90 19.38,47.7 19.38,48.57 arc45 19.26,48.85 19.23,48.88 arc45 18.98,48.98 18.88,48.98 arc-90 18.38,49.49 18.38,55.11 IC6.9 | v16.62,39.86 16.38,40.11 15.5,40.11 15.25,39.86 15.25,36.86 arc90 15.38,36.73 15.5,36.61 15.5,33.68 arc-45 15.36,33.34 14.28,32.27 arc45 14.12,31.89 14.12,30.41 arc-90 13.45,29.73 arc45 13.11,29.59 12.95,29.43 arc-45 12.47,29.23 11.5,29.23 v11.3,29.16
  Bottom 0.406: IC8.2 11.87,17.03 arc-90 v12.2,17.36 | v11.3,29.16 arc-90 10.8,29.66 R1.1
DIO6  (via drill 0.3)
  Top 0.406: v22,17.46 v22,28.16
  Bottom 0.152: IC6.10 18.38,55.86 18.25,55.73 17.75,55.73 17.02,55 arc45 16.38,53.45 16.38,51.11 arc-90 16,50.73 15.71,50.45 arc45 15.62,50.24 15.62,50.1 arc45 15.71,49.9 arc-45 15.75,49.8 15.75,45.61 15.25,45.11 15.25,42.48 16.25,42.48 17.12,43.36 17.12,43.73 21.25,43.73 21.75,43.23 21.75,36.23 arc-90 20.76,35.23 arc90 20.62,35.1 20.62,32.61 arc90 21.38,31.86 21.63,31.61 arc-45 21.75,31.31 21.75,29.86 21.25,29.86 R2.1
  Bottom 0.406: IC5.2 20.81,16.27 arc-90 v22,17.46 | v22,28.16 arc-90 21.26,28.9 R2.1
DIO7  (via drill 0.3)
  Top 0.152: v15.75,51.48 19.11,51.48 arc-45 19.77,51.21 arc45 20.62,50.86 35.88,50.86 arc-45 37.15,50.33 38.45,49.03 arc-45 38.88,48.02 38.88,39.81 arc-45 38.12,37.98 v32.12,31.98
  Top 0.406: v32.5,18.06 32.5,18.86 arc90 30.1,21.26 v30.1,26.86
  Bottom 0.152: v15.75,51.48 arc-90 14,53.23 14,54.77 arc-45 14.15,55.14 14.58,55.56 arc-45 15,55.73 15.39,55.73 arc45 15.79,55.9 15.99,56.1 arc-45 16.91,56.48 18.12,56.48 18.38,56.73 IC6.11 | v32.12,31.98 32.12,30.36 31.62,30.36 R5.1
  Bottom 0.406: IC11.2 31.31,16.87 arc-90 v32.5,18.06 | v30.1,26.86 30.1,28.7 arc-90 R5.1
F_CV
  Bottom 0.406: R18.2 arc90 18.05,40.56 15,40.56 arc90 14.55,40.12 IC1.2 arc-90 14.71,38.53 R19.1 R17.1 12.41,33.67 arc-90 11.3,32.56 arc90 9.3,30.56 9.3,30.36 arc90 12.3,27.36 16.2,27.36 arc90 17.35,28.51 C17.1
F_CV1  (via drill 0.3)
  Top 0.406: v22.7,44.86 28.7,44.86 arc-90 29.7,43.86 29.7,41.96 arc90 v29.8,41.86
  Bottom 0.406: R26.1 22.63,44.93 arc-90 v22.7,44.86 | v29.8,41.86 29.8,40.56 arc-90 29.4,40.16
  Bottom 0.61: R30.1 arc-90 21.64,34.68 C23.1 arc-90 25.46,35.86 26.1,35.86 arc90 26.86,36.62 IC3.2 26.86,39.02 arc-90 28,40.16 29.4,40.16 arc-90 29.7,39.86 29.7,34.68 arc90 R29.2
GND  (via drill 0.3)
  Top 0.152: v19.75,43.11 17.12,43.11 arc-45 16.27,43.46 13.68,46.05 arc45 13.24,46.23 12.74,46.23 arc45 12.33,46.07 12.12,45.86 arc-45 11.82,45.73 11.78,45.73 arc45 11.52,45.62 7.38,41.48 7.38,41.36 | JP1.5 19.88,98.11 19.88,98.1 | 22.38,95.56 22.38,95.61 JP1.8
  Top 0.406: 22.6,97.96 22.5,97.96 19.93,97.96 JP1.6 | LED1.K arc90 7.1,34.11 7.1,34.26 v7.1,36.76 | CV_A2.P$3 7.38,41.36 8.1,41.36 arc-90 v9.7,39.76
  Top 0.61: JP1.7 JP1.5 19.88,98.1 JP1.3 JP1.4 JP1.6 22.38,95.56 JP1.8 22.5,95.56 22.5,97.96 | C5.- arc-90 14.12,83.96 18.73,83.96 arc-90 C6.- arc-90 26.58,88.16 POT_A1.P$3 | CLOCK_IN.P$3 arc-90 5.6,13.96 13.73,13.96 arc-90 RESET.P$3 arc-90 15.93,13.96 24.07,13.96 arc-90 AUDIO_OUT1.P$3 arc-90 25.77,13.46 34.9,13.46 arc-90 AUDIO_OUT2.P$3 | v25.6,36.76 arc-90 26.44,36.02 26.44,34.66 | 26.44,34.66 LED3.K | AVR_ISP.6 12.66,53.8 arc90 14.1,52.36 20,52.36 | 20,52.36 26.5,52.36 arc90 POT_A3.P$3 | 13.3,34.26 14.62,34.26 arc-90 LED2.K 18.92,32.78 arc90 21.1,34.96 | 13.3,34.26 7.1,34.26 | 26.44,34.66 21.4,34.66 arc-90 21.1,34.96 | v13.4,37.06 13.4,34.36 arc-90 13.3,34.26 | v21.1,37.36 21.1,34.96 | DIO6_OUT.P$3 arc90 25.27,28.76 28,28.76 arc-90 32.1,24.66 32.1,22.56 arc90 33.2,21.46 36,21.46 arc-90 37.4,20.06 37.4,13.46 arc-90 36.8,12.86 AUDIO_OUT2.P$3 | 36.3,12.86 AUDIO_OUT2.P$3 | v20.2,51.76 arc-90 20,51.76 20,52.36
  Bottom 0.152: v19.75,43.11 20.5,43.11 20.88,42.73 C20.2 | 26.54,49.61 24.12,49.61 23.88,49.36 20.2,49.36 | CV_A3.P$3 33.5,41.48 27.12,47.86 26.75,47.86 C28.2
  Bottom 0.406: POT_A0.P$3 arc90 6.1,85.76 8.48,85.76 arc-90 C5.- | C1.1 arc-90 24.6,68.23 24.6,66.96 arc-90 23.9,66.26 arc90 23.19,65.55 IC6.21 23.19,59.47 arc90 23.7,58.96 arc-90 23.99,58.67 IC6.3 | v7.1,36.76 arc-90 7.24,36.89 U2.8 9.04,36.89 arc90 9.7,37.56 v9.7,39.76 | IC1.3 13.29,37.17 arc90 v13.4,37.06
  Bottom 0.61: JP1.8 22.47,93.23 arc90 C25.- arc90 20.55,88.19 C6.- arc90 23.26,79.43 D10.A D4.A arc90 25.87,74.96 30.2,74.96 arc-90 32.8,72.36 | JP1.4 17.39,92.44 arc-90 C30.+ | D8.A arc-90 5.3,72.36 CV_A0.P$3 | IC5.3 19.86,10.32 arc90 R6.2 arc90 21.76,11.78 IC5.1 24.96,12.65 arc90 AUDIO_OUT1.P$3 | RESET.P$2 RESET.P$3 13.02,12.86 arc90 IC8.1 12.82,12.44 arc-90 R7.2 arc90 10.92,10.54 IC8.3 | IC7.3 0.77,11.19 arc90 1.5,10.46 arc90 2.67,11.63 IC7.1 arc-90 3.11,12.86 CLOCK_IN.P$3 CLOCK_IN.P$2 | 32.8,72.36 arc90 D6.A arc90 27.8,69.36 C1.1 | 32.8,72.36 CV_A1.P$3 | IC11.3 30.36,10.9 arc90 31.3,9.96 arc90 32.26,10.92 IC11.1 arc-90 32.99,12.86 AUDIO_OUT2.P$3 | C22.2 arc-90 34.18,41.36 CV_A3.P$3 arc-90 35.01,40.15 IC9.1 arc-90 33.89,37.9 C11.2 33.08,36.48 | POT_A2.P$3 arc90 6.4,54.46 AVR_ISP.6 | DIO7_OUT.P$3 arc90 36.77,30.13 LED4.K LED4.K arc90 34.7,34.86 arc-90 33.08,36.48 | IC12.2 arc90 3.32,41.36 CV_A2.P$3 arc90 7.2,42.36 7.2,42.46 arc90 8.21,43.47 C15.2 | C28.2 arc-90 26.54,48.03 26.54,49.61 C3.1 26.54,50.73 arc90 25.8,51.46 25.5,51.46 arc-90 24,52.96 24,53.67 arc90 IC6.3 | C2.1 arc-90 20.2,48.2 20.2,49.36 Y1.2 v20.2,51.76 | IC3.3 arc-90 IC3.3 v25.6,36.76 | DIO5_OUT.P$3 14.83,31.51 arc-90 LED2.K | DIO4_OUT.P$3 4.5,31.51 arc-90 LED1.K | DIO6_OUT.P$3 25.17,31.51 arc-90 LED3.K arc90 26.46,32.76 30,32.76 arc90 33.08,35.84 33.08,36.48 | 11.45,72.36 11.62,72.36 arc-90 C7.1 arc-90 15.1,68.89 15.1,74.96 arc-90 12.21,77.86 C5.- | C27.1 v21.09,37.35 arc90 v21.1,37.36
  Bottom 0.813: CV_A0.P$3 11.45,72.36 arc90 IC2.3
MISO
  Bottom 0.406: AVR_ISP.1 arc-90 16.43,60.77 IC6.16
MOSI  (via drill 0.3)
  Top 0.254: AVR_ISP.4 11.35,55.69 11.35,52.76 13.25,50.86 17.1,50.86 17.3,50.66 17.3,49.16 17.1,48.96 v10.7,48.96 | v10.75,47.11 10.55,46.91 8.1,46.91 7.75,46.56 7.75,45.51 8.1,45.16 v9,45.16 | v6.5,37.61 6.55,37.66 10.9,37.66 11.4,37.16 v11.65,37.16
  Bottom 0.254: v10.7,48.96 10.75,48.91 v10.75,47.11 | v9,45.16 9.05,45.11 9.05,42.91 9.5,42.46 9.5,40.61 9.75,40.36 11.05,40.36 11.35,40.06 11.35,37.46 v11.65,37.16 | U2.7 8.1,37.61 v6.5,37.61
  Bottom 0.406: IC6.15 arc-90 18.49,59.96 17.2,59.96 arc90 16.6,59.36 16.6,58.96 arc-90 15.9,58.26 13.93,58.26 arc90 AVR_ISP.4
N$1
  Bottom 0.61: C14.1 R12.1 arc90 11.85,50.36 7.52,50.36 arc90 R14.2
N$2
  Bottom 0.61: AUDIO_OUT2.P$1 35.5,3.86 arc90 R20.1
N$3
  Top 0.61: CV_A2.P$1 arc90 8.7,55.36 POT_A2.P$1
N$4
  Bottom 0.406: IC3.7 IC3.6 25.59,45.66 arc90 25,46.06 21.63,46.06 arc90 R26.2
  Bottom 0.61: C19.2 19.7,44.53 arc90 R26.2
N$5
  Bottom 0.406: 31.84,98.1 arc90 D1.A
  Bottom 0.61: JP1.9 31.84,98.1
  Bottom 0.813: JP1.10 JP1.9
N$6
  Bottom 0.61: JP1.1 arc90 14.59,98.36 D2.C
  Bottom 0.813: JP1.2 JP1.1
N$7
  Bottom 0.61: R38.1 22.9,19.63 arc-90 DIO6_OUT.P$1
N$8
  Bottom 0.406: C1.2 arc90 22.39,66.57 IC6.20
N$9
  Bottom 0.61: R34.1 12.68,19.51 arc-90 DIO5_OUT.P$1
N$10
  Bottom 0.61: R43.1 33.04,19.82 arc-90 DIO7_OUT.P$1
N$11
  Bottom 0.61: R32.1 2.4,19.46 arc-90 DIO4_OUT.P$1
N$12
  Bottom 0.61: CV_A3.P$1 arc90 36.3,55.36 POT_A3.P$1
N$13
  Bottom 0.61: IC7.4 0.77,17.35 arc-90 R32.2
N$14
  Bottom 0.61: Q1.B 17.46,7.29 arc-90 18.5,6.26 18.5,3.24 arc-90 R4.1
N$15
  Bottom 0.61: RESET.P$1 18.32,1.36 arc90 R4.2
N$16
  Bottom 0.61: R34.2 10.9,15.27 arc90 IC8.4
N$17
  Bottom 0.61: R13.1 arc-90 7.83,4.98 Q5.B
N$18
  Bottom 0.61: IC6.7 20.79,52.57 arc90 21.4,51.96 Y1.1
N$19
  Bottom 0.61: Y1.3 19,52.69 arc-90 IC6.8
N$20
  Bottom 0.61: R1.2 arc90 13.56,31.54 LED2.A
N$21
  Bottom 0.61: R2.2 arc90 23.9,31.2 LED3.A
N$22
  Bottom 0.61: CLOCK_IN.P$1 8.37,1.36 arc90 R13.2
N$23
  Bottom 0.61: R5.2 arc90 34.23,31.13 LED4.A
N$24
  Bottom 0.61: R24.1 arc-90 22.59,41.01 C20.1 23.61,42.68 arc90 IC3.5
N$25
  Top 0.406: CV_A0.P$1 arc90 8.7,86.36 POT_A0.P$1
N$26
  Bottom 0.406: R22.1 arc-90 10.85,41.86 16.93,41.86 arc90 C19.1
  Bottom 0.61: C19.1 18.23,42.83 arc-90 19.6,41.46 arc90 20.13,40.93 R24.2
N$27
  Bottom 0.406: POT_A3.P$2 RC2.1
N$28
  Bottom 0.406: CV_A1.P$1 arc90 36.3,86.36 POT_A1.P$1
N$29
  Bottom 0.61: RC3.1 POT_A2.P$2 arc90 POT_A2.P$2
N$30
  Bottom 0.406: RC1.1 arc90 6.2,90.71 POT_A0.P$2
N$31
  Bottom 0.406: RC4.1 arc90 33.8,87.91 POT_A1.P$2
N$32
  Bottom 0.61: AUDIO_OUT1.P$1 25.17,3.72 arc90 R31.1
N$33
  Bottom 0.406: R9.1 arc90 2.54,33.97 L1.2
N$42  (via drill 0.3)
  Top 0.406: v10.7,39.66 10.7,42.96 arc-90 v13.3,45.56
  Bottom 0.406: R17.2 v10.71,39.65 arc90 v10.7,39.66 | v13.3,45.56 13.3,43.91 arc-90 IC1.6
  Bottom 0.61: IC1.6 IC1.7 14.55,47.06 arc-90 C14.2
N$43
  Bottom 0.61: R14.1 arc-90 9.91,46.31 C15.1 arc90 10.2,43.89 IC1.5
N$45
  Bottom 0.61: R38.2 19.97,15.35 arc-90 IC5.4
N$46
  Bottom 0.61: IC11.4 30.36,18.1 arc90 R43.2
N$54
  Bottom 0.61: R33.2 arc90 3.23,31.13 LED1.A
RESET  (via drill 0.3)
  Top 0.406: v19.4,64.36 21.08,62.68 arc45 22.09,62.26 26.83,62.26 arc-45 27.97,61.79 arc-45 28.1,61.48 v28.1,57.56 27.09,57.56 IC6.29 18.99,57.57 arc45 17.84,57.09 AVR_ISP.5
  Bottom 0.406: R3.1 v19.4,64.36 | v28.1,57.56 v28.09,57.57 IC6.29
SCK  (via drill 0.3)
  Top 0.254: v5.5,37.86 4.1,37.86 1.9,40.06 v1.9,40.36 | v5.6,45.96 5,46.56 5,50.16 6.3,51.46 7,51.46 9.6,54.06 v9.6,55.56
  Top 0.406: AVR_ISP.3 15.84,57 arc90 17,58.16 17,61.26 arc-90 18,62.26 v19.3,62.26
  Bottom 0.254: U2.6 arc-90 8.15,38.16 5.7,38.16 arc90 5.5,37.96 v5.5,37.86 | v1.9,40.36 1.9,40.66 2.3,41.06 2.3,42.56 2.9,43.16 6.7,43.16 7.4,43.86 7.4,45.26 6.7,45.96 v5.6,45.96 | v9.6,55.56 9.75,55.71 13.6,55.71 14.89,57 AVR_ISP.3
  Bottom 0.406: v19.3,62.26 IC6.17 arc90 IC6.17
SS  (via drill 0.3)
  Top 0.254: v8.8,39.56 8.8,39.66 8.4,40.06 5.7,40.06 4.5,41.26 4.5,54.56 3.9,55.16 2.8,55.16 2.2,55.76 2.2,58.66 3,59.46 4.7,59.46 6.4,61.16 6.4,68.26 8.4,70.26 v11.6,70.26 | v14.1,69.66 14.7,69.06 14.7,62.06 15.1,61.66 16,61.66 16.7,62.36 16.7,63.16 16.8,63.26 19.4,63.26 20.3,62.36 v20.3,59.06
  Bottom 0.254: U2.5 v8.8,39.56 | v11.6,70.26 12.2,69.66 v14.1,69.66 | v20.3,59.06 20.19,59.17 IC6.14
VCC  (via drill 0.3)
  Top 0.61: C5.+ 14.74,81.92 arc90 16.9,79.76 19.1,79.76 | 19.1,79.76 arc90 v24,84.66 | 19.1,79.76 19.1,78.56 arc90 20.2,77.46 20.2,70.76 arc-90 16.6,67.16 arc90 15.7,66.26 v15.7,62.66 | v10.1,61.46 arc-90 10.6,60.96 10.6,52.96 arc90 13.4,50.16 v16.3,50.16
  Bottom 0.152: IC2.1 20.12,76.23 20.12,81.11 19.12,82.11 19.12,83.23 15.88,83.23 14.75,82.11 C5.+
  Bottom 0.406: IC1.8 arc-90 18.8,46.86 23.75,46.86 arc90 C28.1 | C28.1 24.88,47.88 arc90 26,46.76 27.2,46.76 arc-90 28.14,45.83 IC3.8 | C28.1 24.9,48.01 24.9,49.16
  Bottom 0.61: D1.C arc-90 29.2,91.66 28.1,91.66 arc90 26.4,89.96 26.4,87.66 arc-90 25.61,86.87 C25.+ arc90 24,86.84 v24,84.66 | v15.7,62.66 arc-90 14.5,61.46 v10.1,61.46 | v16.3,50.16 16.3,44.37 arc-90 IC1.8
VEE  (via drill 0.3)
  Top 0.61: v12.4,86.16 arc90 9,82.76 9,80.06 arc-90 7.9,78.96 4,78.96 arc90 1.9,76.86 1.9,68.06 arc90 2.9,67.06 3.7,67.06 arc-90 4.9,65.86 4.9,63.06 arc-90 2.8,60.96 arc90 1.4,59.56 1.4,44.06 arc90 6.77,38.69 IC1.4 | IC1.4 arc90 12.52,38.19 21,38.19 | 21,38.19 IC3.4 arc90 24.4,38.27 v24.4,39.96 arc-90 24.44,40 R25.1 arc90 R25.1 v38.3,40.96 | IC1.4 arc-90 12,38.7 v12,40.46 | v21,39.06 21,38.19
  Bottom 0.61: D2.A arc90 10.4,92.06 12.5,92.06 arc-90 14,90.56 14,88.36 arc90 15.78,86.58 C30.- arc-90 15.91,86.16 v12.4,86.16 | v24.4,39.96 arc90 24.32,39.88 IC3.4 | v12,40.46 arc-90 12.02,40.45 IC1.4 | v38.3,40.96 arc90 v38.29,40.95 R25.1 | C27.2 v20.99,39.05 arc90 v21,39.06

### Text on the board
bNames: -12v